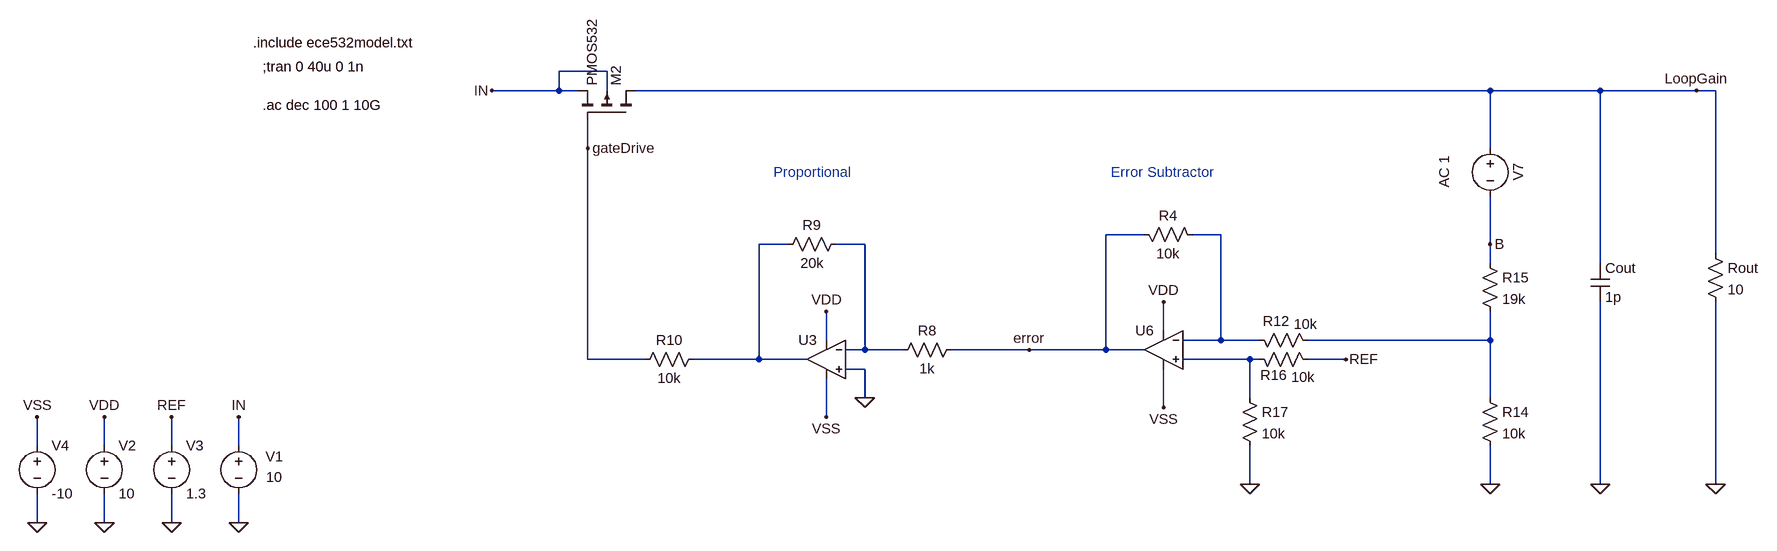
[diagram p0: schematic PID_2_AC.asc]
PID_2_AC.asc, the LTspice schematic file:
Version 4
SHEET 1 3668 1572
WIRE -448 64 -528 64
WIRE -528 96 -528 64
WIRE -528 96 -688 96
WIRE -496 96 -528 96
WIRE -448 96 -448 64
WIRE 1328 96 -400 96
WIRE 1520 96 1328 96
WIRE 1680 96 1520 96
WIRE 1712 96 1680 96
WIRE -480 192 -480 144
WIRE 1328 192 1328 96
WIRE 528 336 464 336
WIRE 656 336 608 336
WIRE -96 352 -144 352
WIRE 32 352 -16 352
WIRE 1328 352 1328 272
WIRE 1712 368 1712 96
WIRE 1328 384 1328 352
WIRE 1520 384 1520 96
WIRE 560 496 560 448
WIRE -32 512 -32 464
WIRE 656 512 656 336
WIRE 656 512 592 512
WIRE 720 512 656 512
WIRE 1328 512 1328 464
WIRE 1328 512 800 512
WIRE 32 528 32 352
WIRE 32 528 0 528
WIRE 96 528 32 528
WIRE 336 528 176 528
WIRE 464 528 464 336
WIRE 464 528 336 528
WIRE 528 528 464 528
WIRE -480 544 -480 192
WIRE -384 544 -480 544
WIRE -144 544 -144 352
WIRE -144 544 -304 544
WIRE -64 544 -144 544
WIRE 704 544 592 544
WIRE 720 544 704 544
WIRE 864 544 800 544
WIRE 32 560 0 560
WIRE 32 608 32 560
WIRE 704 608 704 544
WIRE 1328 608 1328 512
WIRE 560 624 560 560
WIRE -32 640 -32 576
WIRE -1536 688 -1536 640
WIRE -1424 688 -1424 640
WIRE -1312 688 -1312 640
WIRE -1200 688 -1200 640
WIRE 704 752 704 688
WIRE 1328 752 1328 688
WIRE 1520 752 1520 448
WIRE 1712 752 1712 448
WIRE -1536 816 -1536 768
WIRE -1424 816 -1424 768
WIRE -1312 816 -1312 768
WIRE -1200 816 -1200 768
FLAG 1520 752 0
FLAG -1424 816 0
FLAG -1424 640 VDD
FLAG 1712 752 0
FLAG -1312 816 0
FLAG 1680 96 LoopGain
FLAG -1312 640 REF
FLAG -1536 816 0
FLAG -1536 640 VSS
FLAG -1200 816 0
FLAG -688 96 IN
FLAG -32 464 VDD
FLAG -32 640 VSS
FLAG 32 608 0
FLAG 704 752 0
FLAG 560 448 VDD
FLAG 560 624 VSS
FLAG 864 544 REF
FLAG -1200 640 IN
FLAG 336 528 error
FLAG 1328 752 0
FLAG 1328 352 B
FLAG -480 192 gateDrive
SYMBOL cap 1504 384 R0
SYMATTR InstName Cout
SYMATTR Value 1p
SYMBOL voltage -1424 672 R0
WINDOW 123 0 0 Left 2
WINDOW 39 0 0 Left 2
SYMATTR InstName V2
SYMATTR Value 10
SYMBOL res 1696 352 R0
SYMATTR InstName Rout
SYMATTR Value 10
SYMBOL voltage -1312 672 R0
WINDOW 123 0 0 Left 2
WINDOW 39 0 0 Left 2
SYMATTR InstName V3
SYMATTR Value 1.3
SYMBOL voltage -1536 672 R0
WINDOW 123 0 0 Left 2
WINDOW 39 0 0 Left 2
SYMATTR InstName V4
SYMATTR Value -10
SYMBOL pmos4 -400 144 M270
SYMATTR InstName M2
SYMATTR Value PMOS532
SYMATTR Value2 l=1u w=1000u m=1
SYMBOL voltage -1200 672 R0
WINDOW 123 0 0 Left 2
WINDOW 39 0 0 Left 2
WINDOW 0 45 34 Left 2
WINDOW 3 46 68 Left 2
SYMATTR InstName V1
SYMATTR Value 10
SYMBOL Opamps\\UniversalOpamp2 -32 544 M0
SYMATTR InstName U3
SYMBOL res 80 544 R270
WINDOW 0 32 56 VTop 2
WINDOW 3 0 56 VBottom 2
SYMATTR InstName R8
SYMATTR Value 1k
SYMBOL res -112 368 R270
WINDOW 0 32 56 VTop 2
WINDOW 3 0 56 VBottom 2
SYMATTR InstName R9
SYMATTR Value 20k
SYMBOL res -400 560 R270
WINDOW 0 32 56 VTop 2
WINDOW 3 0 56 VBottom 2
SYMATTR InstName R10
SYMATTR Value 10k
SYMBOL res 1312 592 R0
SYMATTR InstName R14
SYMATTR Value 10k
SYMBOL res 1312 368 R0
SYMATTR InstName R15
SYMATTR Value 19k
SYMBOL res 512 320 M90
WINDOW 0 0 56 VBottom 2
WINDOW 3 32 56 VTop 2
SYMATTR InstName R4
SYMATTR Value 10k
SYMBOL res 704 496 M90
WINDOW 0 0 44 VBottom 2
WINDOW 3 -26 93 VTop 2
SYMATTR InstName R12
SYMATTR Value 10k
SYMBOL res 704 528 M90
WINDOW 0 58 40 VBottom 2
WINDOW 3 30 89 VTop 2
SYMATTR InstName R16
SYMATTR Value 10k
SYMBOL res 688 592 R0
SYMATTR InstName R17
SYMATTR Value 10k
SYMBOL Opamps\\UniversalOpamp2 560 528 M0
SYMATTR InstName U6
SYMBOL voltage 1328 176 R0
WINDOW 0 32 56 VTop 2
WINDOW 3 -32 56 VBottom 2
WINDOW 123 -60 56 VBottom 2
WINDOW 39 0 0 Left 2
SYMATTR InstName V7
SYMATTR Value ""
SYMATTR Value2 AC 1
TEXT -1176 16 Left 2 !.include ece532model.txt
TEXT -1160 56 Left 2 !;tran 0 40u 0 1n
TEXT -120 232 Left 2 ;Proportional
TEXT 472 232 Left 2 ;Error Subtractor
TEXT -1160 120 Left 2 !.ac dec 100 1 10G

The netlist it stands for:
* PID_2_AC.asc
Cout LoopGain 0 1p
V2 VDD 0 10
Rout LoopGain 0 10
V3 REF 0 1.3
V4 VSS 0 -10
M2 LoopGain gateDrive IN IN PMOS532 l=1u w=1000u m=1
V1 IN 0 10
XU3 0 N003 VDD VSS N002 level.2 Avol=1Meg GBW=10Meg Slew=10Meg ilimit=25m rail=0 Vos=0 phimargin=45 en=0 enk=0 in=0 ink=0 Rin=500Meg  ; pins IN+ IN- V+ V- OUT
R8 N003 error 1k
R9 N002 N003 20k
R10 gateDrive N002 10k
R14 N004 0 10k
R15 B N004 19k
R4 error N001 10k
R12 N001 N004 10k
R16 N005 REF 10k
R17 N005 0 10k
XU6 N005 N001 VDD VSS error level.2 Avol=1Meg GBW=10Meg Slew=10Meg ilimit=25m rail=0 Vos=0 phimargin=45 en=0 enk=0 in=0 ink=0 Rin=500Meg  ; pins IN+ IN- V+ V- OUT
V7 LoopGain B AC 1
.model NMOS NMOS
.model PMOS PMOS
.lib standard.mos
.include ece532model.txt
;tran 0 40u 0 1n
* Proportional
* Error Subtractor
.ac dec 100 1 10G
.lib UniversalOpamps2.sub
.backanno
.end